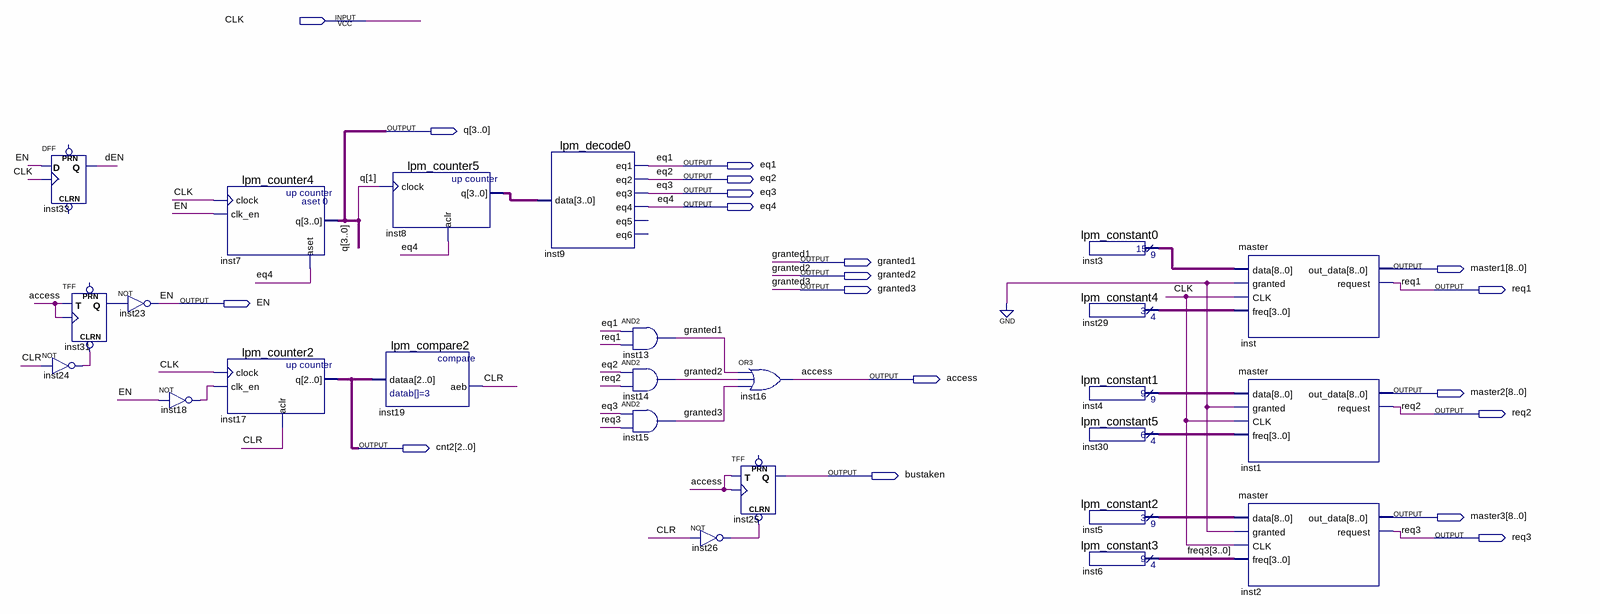
[diagram p0: schematic sheet]
// Quartus schematic main.bdf as structural Verilog: 25 symbols, 19 pins
module main (
  input  CLK,
  output [3:0] q,
  output eq1,
  output eq2,
  output eq3,
  output eq4,
  output granted1,
  output [8:0] master1,
  output granted2,
  output granted3,
  output req1,
  output EN,
  output access,
  output [8:0] master2,
  output req2,
  output [2:0] cnt2,
  output bustaken,
  output [8:0] master3,
  output req3
);

  wire CLR, dEN, inst18_out, inst24_out, inst26_out, inst31_q;
  wire [3:0] freq3, inst8_q, inst29_result, inst30_result;
  wire [8:0] inst3_result, inst4_result, inst5_result;

  DFF inst33 (.CLK(CLK), .D(EN), .Q(dEN));  // open: CLRN, PRN
  not inst24 (inst24_out, CLR);
  TFF inst31 (.CLRN(inst24_out), .T(access), .CLK(access), .Q(inst31_q));  // open: PRN
  not inst23 (EN, inst31_q);
  not inst18 (inst18_out, EN);
  lpm_counter4 inst7 (.clock(CLK), .clk_en(EN), .aset(eq4), .q(q));
  lpm_counter2 inst17 (.clock(CLK), .clk_en(inst18_out), .aclr(CLR), .q(cnt2));
  lpm_counter5 inst8 (.clock(q[1]), .aclr(eq4), .q(inst8_q));
  lpm_compare2 inst19 (.dataa(cnt2), .aeb(CLR));
  lpm_decode0 inst9 (.data(inst8_q), .eq1(eq1), .eq2(eq2), .eq3(eq3), .eq4(eq4));  // open: eq5, eq6
  and inst13 (granted1, eq1, req1);
  and inst14 (granted2, eq2, req2);
  and inst15 (granted3, eq3, req3);
  not inst26 (inst26_out, CLR);
  or inst16 (access, granted1, granted2, granted3);
  TFF inst25 (.CLRN(inst26_out), .T(access), .CLK(access), .Q(bustaken));  // open: PRN
  lpm_constant0 inst3 (.result(inst3_result));
  lpm_constant4 inst29 (.result(inst29_result));
  lpm_constant1 inst4 (.result(inst4_result));
  lpm_constant5 inst30 (.result(inst30_result));
  lpm_constant2 inst5 (.result(inst5_result));
  lpm_constant3 inst6 (.result(freq3));
  master inst (
    .data(inst3_result), .granted(1'b0), .CLK(CLK), .freq(inst29_result), .out_data(master1), .request(req1));
  master inst1 (
    .data(inst4_result), .granted(1'b0), .CLK(CLK), .freq(inst30_result), .out_data(master2), .request(req2));
  master inst2 (.data(inst5_result), .granted(1'b0), .CLK(CLK), .freq(freq3), .out_data(master3), .request(req3));
endmodule
